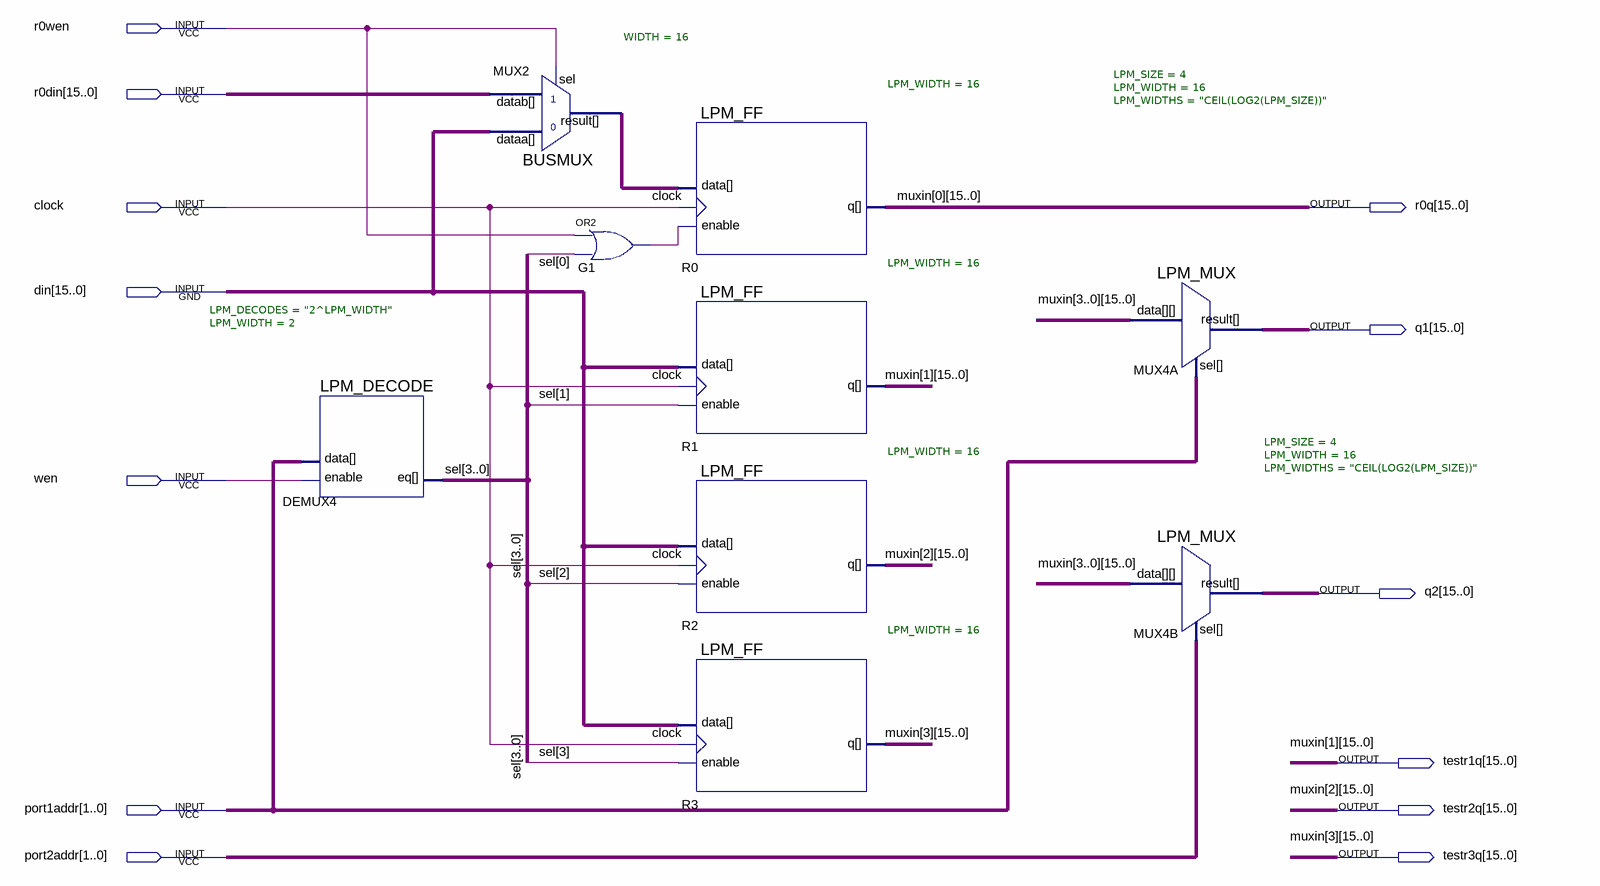
[diagram p0: schematic sheet]
// Quartus schematic regfile.bdf as structural Verilog: 9 symbols, 13 pins
module regfile (
  input  r0wen,
  input  [15:0] r0din,
  input  clock,
  input  [15:0] din,
  input  wen,
  input  [1:0] port1addr,
  input  [1:0] port2addr,
  output [15:0] r0q,
  output [15:0] q1,
  output [15:0] q2,
  output [15:0] testr1q,
  output [15:0] testr2q,
  output [15:0] testr3q
);

  wire G1_out;
  wire [3:0] sel;
  wire [15:0] MUX2_result;

  LPM_DECODE #(.LPM_DECODES("2^LPM_WIDTH"), .LPM_WIDTH(2)) DEMUX4 (.data(port1addr), .enable(wen), .eq(sel));
  BUSMUX #(.WIDTH(16)) MUX2 (.datab(r0din), .sel(r0wen), .dataa(din), .result(MUX2_result));
  or G1 (G1_out, r0wen, sel[0]);
  LPM_FF #(.LPM_WIDTH(16)) R0 (.clock(clock), .data(MUX2_result), .enable(G1_out), .q(r0q));
  LPM_FF #(.LPM_WIDTH(16)) R1 (.clock(clock), .data(din), .enable(sel[1]), .q(testr1q));
  LPM_FF #(.LPM_WIDTH(16)) R2 (.clock(clock), .data(din), .enable(sel[2]), .q(testr2q));
  LPM_FF #(.LPM_WIDTH(16)) R3 (.clock(clock), .data(din), .enable(sel[3]), .q(testr3q));
  LPM_MUX #(.LPM_SIZE(4), .LPM_WIDTH(16), .LPM_WIDTHS("CEIL(LOG2(LPM_SIZE))")) MUX4A (
    .data({testr3q, testr2q, testr1q, r0q}), .sel(port1addr), .result(q1));
  LPM_MUX #(.LPM_SIZE(4), .LPM_WIDTH(16), .LPM_WIDTHS("CEIL(LOG2(LPM_SIZE))")) MUX4B (
    .data({testr3q, testr2q, testr1q, r0q}), .sel(port2addr), .result(q2));

  // Other names for the same wires on the sheet: muxin_0[15:0] = r0q; muxin_1[15:0] = testr1q;
  //   muxin_2[15:0] = testr2q; muxin_3[15:0] = testr3q
endmodule
